# EAGLE design power (EAGLE 7.5.0)
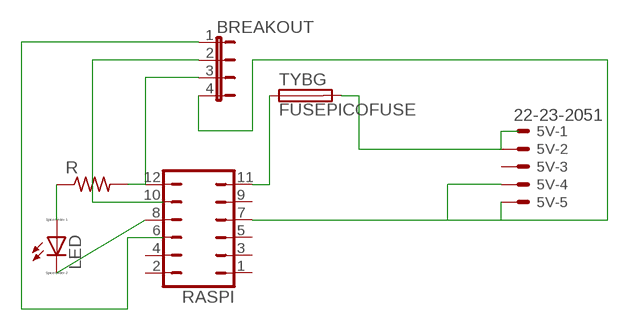
[diagram p0: schematic, sheet 1]

## Parts
5V  22-23-2051  [22-23-2051]
BREAKOUT  JP4E  [JP4]
LED  LED_ELD260  [LED_LD260]
R  R-US_0204/7  [0204/7]
RASPI  JP6Q  [JP6Q]
TYBG  FUSEPICOFUSE  [PICOFUSE]

## Nets
N$1: 5V.1 5V.2 TYBG.2
N$2: BREAKOUT.3 R.2 RASPI.12
N$3: LED.A R.1
N$4: BREAKOUT.1
N$5: RASPI.11 TYBG.1
N$6: 5V.4 5V.5 BREAKOUT.4 RASPI.7
N$7: BREAKOUT.2
N$8: LED.K(C) RASPI.8
Unconnected: 5V.3 RASPI.1 RASPI.2 RASPI.3 RASPI.4 RASPI.5 RASPI.6 RASPI.9 RASPI.10

## Library data of the parts
5V = con-molex:22-23-2051: .100" (2.54mm) Center Header - 5 Pin; MF: MOLEX; MPN: 22-23-2051; OC_FARNELL: 1462952; OC_NEWARK: 38C9178
BREAKOUT = jumper:JP4E: JUMPER
LED = eagle-ltspice:LED_E: LED Source: http://www.osram.convergy.de Source: www.luxeon.com Source: www.kingbright.com; SPICEMODEL: NONE; SPICEPREFIX: D; SPICETYPE: diode
R = resistor:R-US_: RESISTOR, American symbol
RASPI = jumper:JP6Q: JUMPER
TYBG = fuse:FUSE: Fuse; OC_FARNELL: unknown; OC_NEWARK: unknown

## Module RASPI
Ports: 

### Library data of the parts

## Board
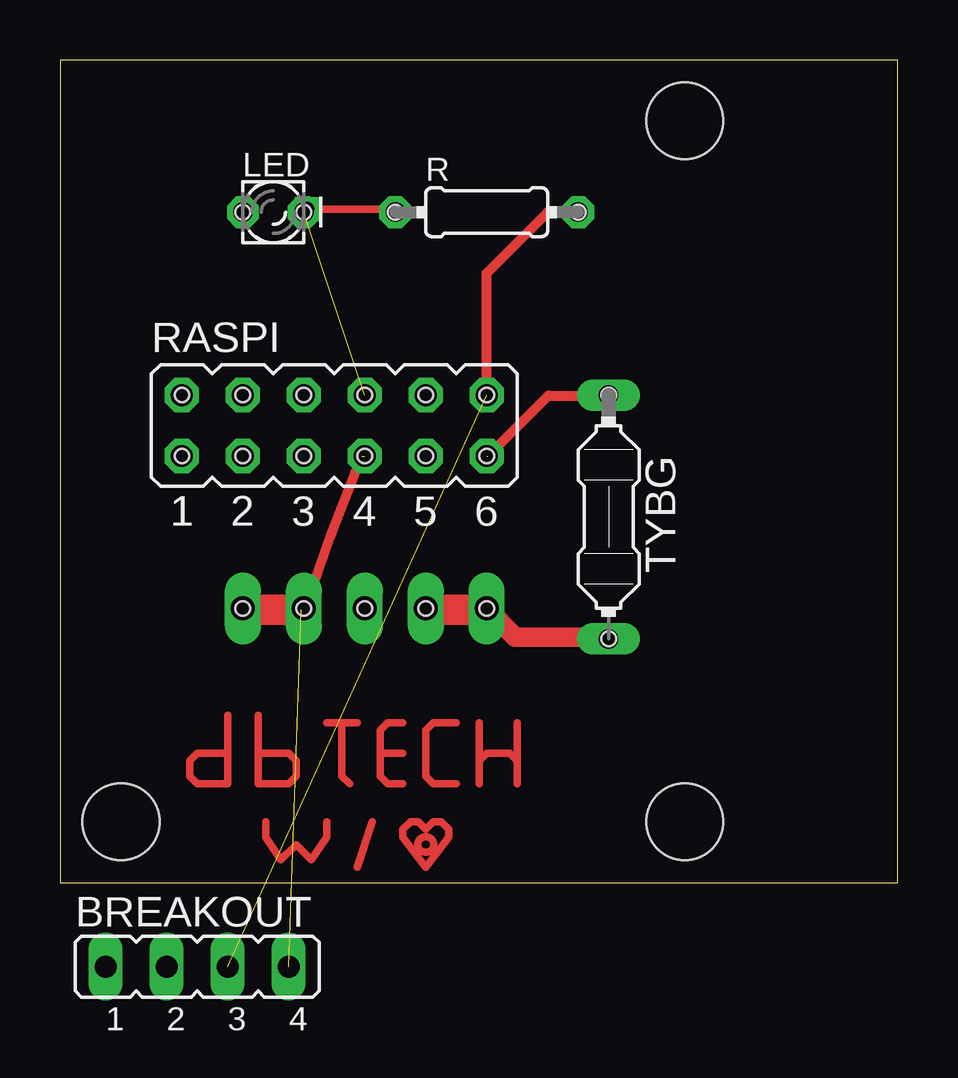
[diagram p1: board, top side]
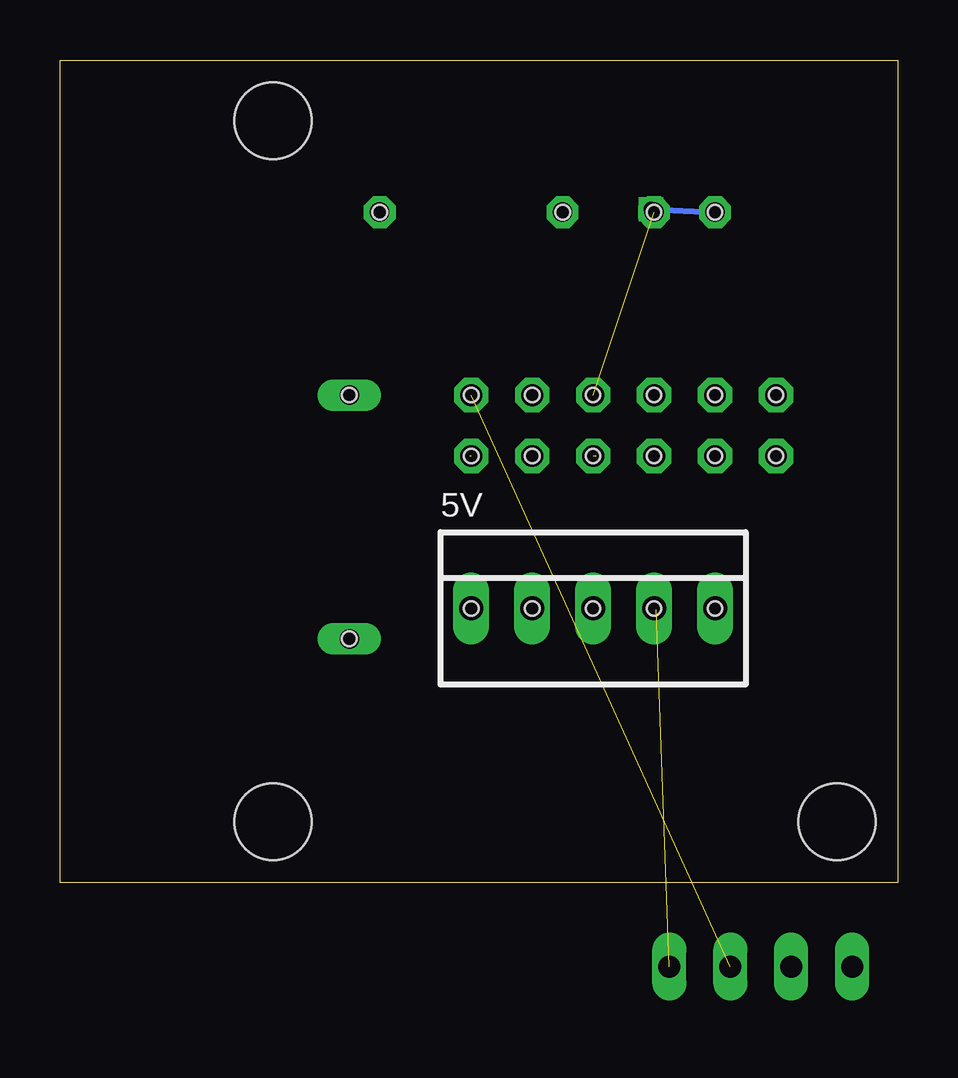
[diagram p2: board, bottom side, seen from below]

Size 34.91 x 34.28 mm. Coordinates in mm from the lower left corner, seen from the top.
Outline: 0,0 34.91,0 34.91,34.28 0,34.28 0,0
Copper layers (1*16): Top 0.035mm / dielectric 1.5mm / Bottom 0.035mm
Design rules "default": minimum track width 10mil, minimum drill 24mil, track to track 8mil, track to pad 8mil, pad to pad 8mil, via to via 8mil, smd to smd 8mil, copper to edge 40mil, drill to drill 8mil, minimum pad ring 10mil, minimum via ring 8mil, stop-mask expansion 4mil, vias tented up to drill 0mil, thermal gap 10mil
Holes 0.6 mm at 5.08,17.78 7.62,17.78 10.16,17.78 12.7,17.78 15.24,17.78 17.78,17.78 17.78,20.32 15.24,20.32 12.7,20.32 10.16,20.32 7.62,20.32 5.08,20.32 7.62,27.94 10.16,27.94 13.97,27.94 21.59,27.94 22.86,20.32 17.78,11.43 15.24,11.43 12.7,11.43 10.16,11.43 7.62,11.43 22.86,10.16
Holes 3.2 mm at 2.54,2.54 26.04,2.54 26.04,31.75

### Footprints (pad centres in the part's own frame; a part is rotated, then mirrored left to right if it is on the bottom)
22-23-2051 = drill 1 long: 1 -5.08,0; 2 -2.54,0; 3 0,0; 4 2.54,0; 5 5.08,0
JP4 = drill 0.914 long: 1 -3.81,0; 2 -1.27,0; 3 1.27,0; 4 3.81,0
LED_LD260 = drill 0.813 octagon: A -1.27,0; K 1.27,0
0204/7 = drill 0.813 octagon: 1 -3.81,0; 2 3.81,0
JP6Q = drill 0.914 octagon: 1 -6.35,-1.27; 2 -6.35,1.27; 3 -3.81,-1.27; 4 -3.81,1.27; 5 -1.27,-1.27; 6 -1.27,1.27; 7 1.27,-1.27; 8 1.27,1.27; 9 3.81,-1.27; 10 3.81,1.27; 11 6.35,-1.27; 12 6.35,1.27
PICOFUSE = drill 0.813 long: 1 -5.08,0; 2 5.08,0

### Placement (x,y rotation side)
5V  12.7,11.43 0 bottom
BREAKOUT  5.71,-3.49 0 top  (outside the outline)
LED  8.89,27.94 0 top
R  17.78,27.94 0 top
RASPI  11.43,19.05 0 top
TYBG  22.86,15.24 270 top

### Tracks (layer width: path | path; a pad name or v marks a point on that pad's centre or on a via)
N$1
  Top 0.254: 15.32,11.38 5V.2 | 17.6,11.38 5V.1 | 22.86,10.24 TYBG.2
  Top 0.813: 22.86,10.24 18.97,10.24 5V.1
  Top 1.27: 17.6,11.38 15.32,11.38
  Bottom 0.254: 22.86,10.24 TYBG.2
N$2  (1 unrouted)
  Top 0.406: RASPI.12 17.78,25.4 20.32,27.94 R.2
N$3  (via drill 0.6)
  Top 0.254: 13.95,28.07 R.1
  Top 0.305: 13.95,28.07 v10.29,28.07
  Bottom 0.254: v10.29,28.07 LED.A
N$5  (1 unrouted)
  Top 0.254: 22.86,20.29 TYBG.1
  Top 0.406: 22.86,20.29 20.34,20.29 17.83,17.78
N$6  (2 unrouted)
  Top 0.254: 10.29,11.61 5V.4 10.06,11.38 | 7.77,11.38 5V.5
  Top 0.406: 12.57,17.78 11.3,14.53 10.29,11.61
  Top 1.27: 10.06,11.38 7.77,11.38
N$8  (1 unrouted)
S$1
  Top 0.305: 13.34,5.4 14.29,5.4 | 14.29,6.67 13.65,6.67 13.34,6.35 13.34,5.4 | 13.34,5.4 13.34,4.45 13.65,4.13 14.29,4.13
S$2
  Top 0.305: 16.51,6.67 15.56,6.67 15.24,6.35 15.24,4.45 15.56,4.13 16.51,4.13
S$3
  Top 0.305: 17.46,6.67 17.46,4.13
S$5
  Top 0.305: 6.99,6.98 6.99,5.4 | 6.99,5.4 6.99,4.13 5.71,4.13 5.4,4.45 5.4,5.08 5.71,5.4 6.99,5.4
S$7
  Top 0.305: 8.26,6.98 8.26,5.4 | 8.26,5.4 8.26,4.13 9.53,4.13 9.84,4.45 9.84,5.08 9.53,5.4 8.26,5.4
S$10
  Top 0.305: 8.57,2.54 8.57,1.9 9.21,0.95 9.84,1.59 10.48,0.95 11.11,1.9 11.11,2.54
S$11
  Top 0.305: 17.46,5.08 17.78,5.4 18.73,5.4 19.05,5.08 | 19.05,5.08 19.05,4.13 | 19.05,5.08 19.05,6.67
S$12
  Top 0.305: 11.75,6.67 11.75,4.45 12.07,4.13
S$13
  Top 0.305: 11.11,6.67 12.38,6.67
S$14
  Top 0.305: 12.38,0.63 13.02,2.54
S$15
  Top 0.305: 15.24,0.63 14.29,1.9 14.29,2.22 14.61,2.54 14.92,2.54 15.24,2.22 15.56,2.54 15.88,2.54 16.19,2.22 16.19,1.9 15.24,0.63
(copper drawn outside any net)
  shapes: Top circle x1